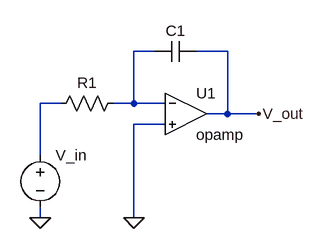
[diagram p0: schematic integrator_opamp.asc]
integrator_opamp.asc, the LTspice schematic file:
Version 4.1
SHEET 1 880 680
WIRE 240 32 208 32
WIRE 352 32 304 32
WIRE 96 112 64 112
WIRE 208 112 208 32
WIRE 208 112 176 112
WIRE 256 112 208 112
WIRE 352 128 352 32
WIRE 352 128 320 128
WIRE 400 128 352 128
WIRE 256 144 208 144
WIRE 64 192 64 112
WIRE 64 288 64 272
WIRE 208 288 208 144
FLAG 208 288 0
FLAG 64 288 0
FLAG 400 128 V_out
SYMBOL res 192 96 R90
WINDOW 0 0 56 VBottom 2
WINDOW 3 32 56 VTop 2
SYMATTR InstName R1
SYMATTR Value ""
SYMBOL OpAmps\\opamp 288 64 R0
SYMATTR InstName U1
SYMBOL voltage 64 176 R0
WINDOW 123 0 0 Left 0
WINDOW 39 0 0 Left 0
SYMATTR InstName V_in
SYMATTR Value ""
SYMBOL cap 304 16 R90
WINDOW 0 0 32 VBottom 2
WINDOW 3 32 32 VTop 2
SYMATTR InstName C1
SYMATTR Value ""

The netlist it stands for:
* integrator_opamp.asc
R1 N001 N002
X§U1 N001 0 V_out opamp Aol=100K GBW=10Meg  ; pins invin noninvin out
V_in N002 0
C1 V_out N001
.backanno
.end